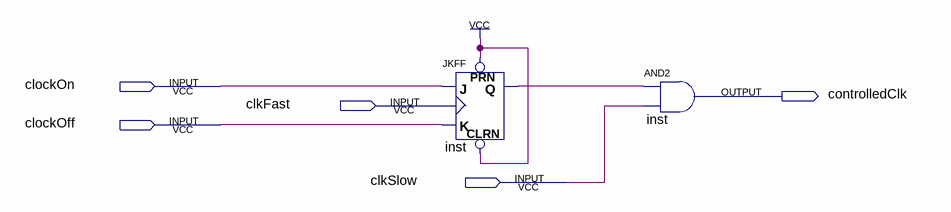
[diagram p0: schematic sheet]
// Quartus schematic clkController.bdf as structural Verilog: 2 symbols, 5 pins
module clkController (
  input  clockOn,
  input  clkFast,
  input  clockOff,
  input  clkSlow,
  output controlledClk
);

  wire inst_q;

  JKFF inst (.PRN(1'b1), .CLRN(1'b1), .K(clockOff), .J(clockOn), .CLK(clkFast), .Q(inst_q));
  and inst_dup2 (controlledClk, inst_q, clkSlow);
endmodule
